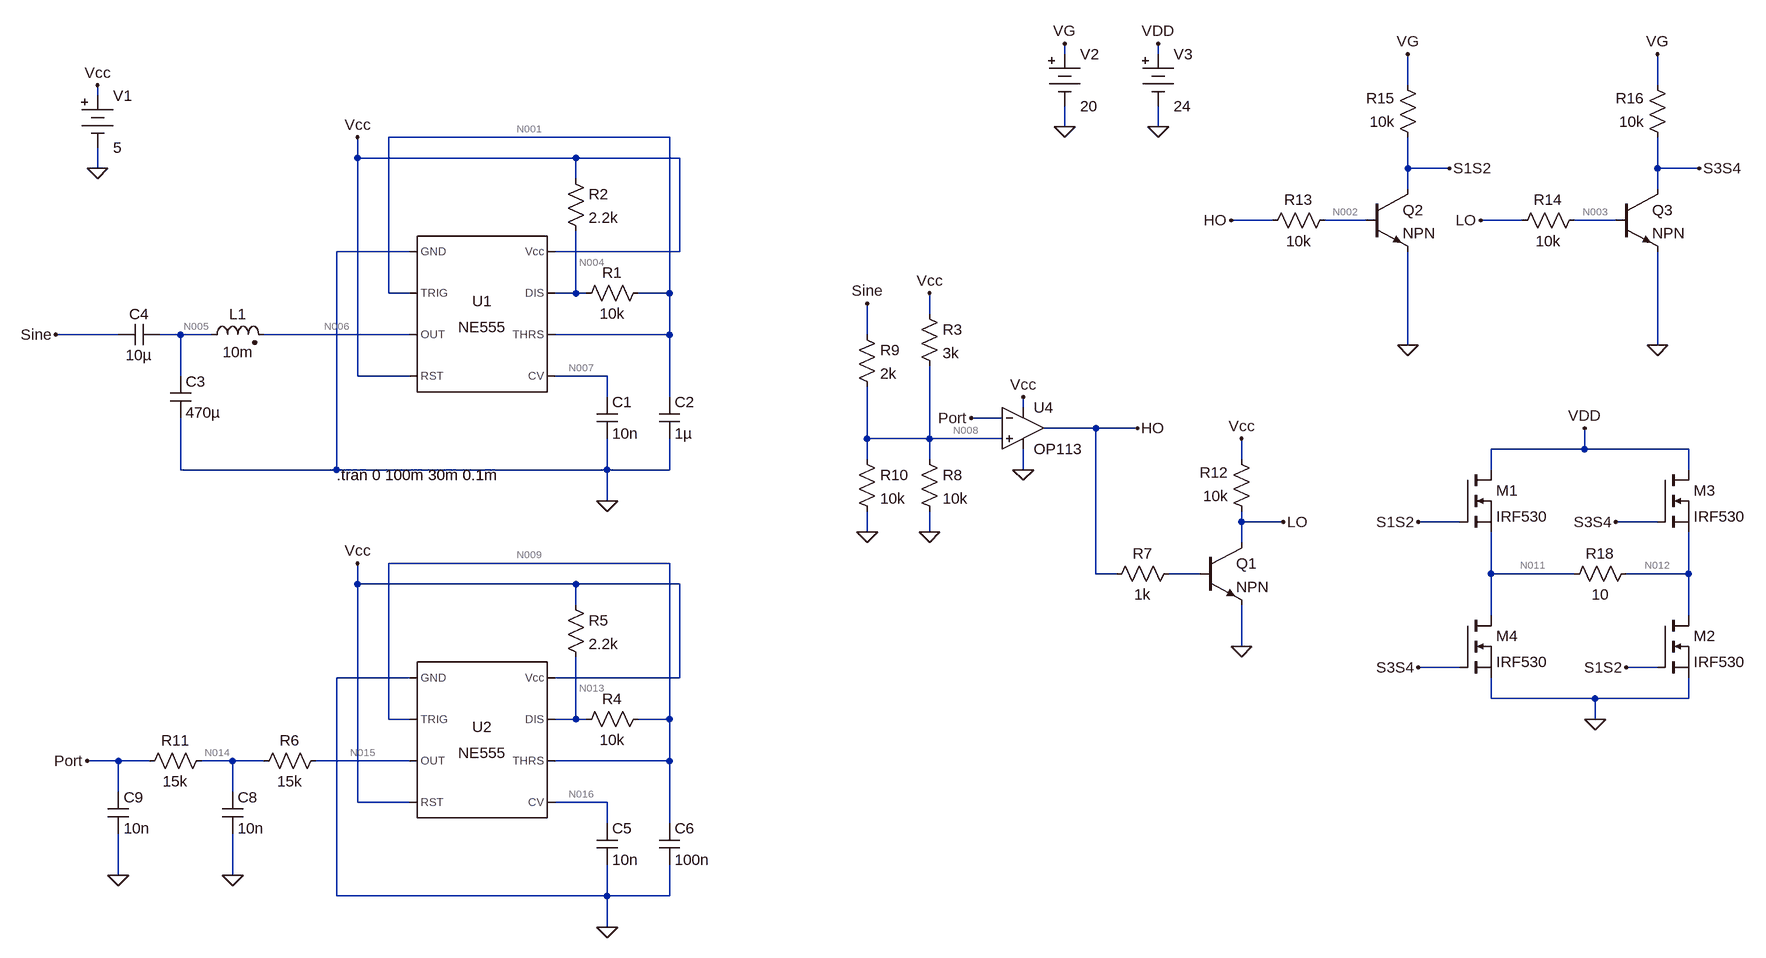
[diagram p0: schematic SPWM.asc]
SPWM.asc, the LTspice schematic file:
Version 4
SHEET 1 3300 1176
WIRE 1072 -208 1072 -224
WIRE 1216 -208 1216 -224
WIRE 1600 -160 1600 -208
WIRE 1984 -160 1984 -208
WIRE -416 -144 -416 -160
WIRE 1072 -96 1072 -128
WIRE 1216 -96 1216 -128
WIRE 464 -80 32 -80
WIRE -16 -48 -16 -80
WIRE 320 -48 -16 -48
WIRE 480 -48 320 -48
WIRE -416 -32 -416 -64
WIRE 1600 -32 1600 -80
WIRE 1664 -32 1600 -32
WIRE 1984 -32 1984 -80
WIRE 2048 -32 1984 -32
WIRE 320 -16 320 -48
WIRE 1600 0 1600 -32
WIRE 1984 0 1984 -32
WIRE 1392 48 1328 48
WIRE 1536 48 1472 48
WIRE 1776 48 1712 48
WIRE 1920 48 1856 48
WIRE 64 96 -48 96
WIRE 480 96 480 -48
WIRE 480 96 288 96
WIRE 32 160 32 -80
WIRE 64 160 32 160
WIRE 320 160 320 64
WIRE 320 160 288 160
WIRE 336 160 320 160
WIRE 464 160 464 -80
WIRE 464 160 416 160
WIRE 864 192 864 160
WIRE -384 224 -480 224
WIRE -288 224 -320 224
WIRE -240 224 -288 224
WIRE 64 224 -160 224
WIRE 464 224 464 160
WIRE 464 224 288 224
WIRE 768 224 768 176
WIRE 1600 240 1600 96
WIRE 1984 240 1984 96
WIRE -288 288 -288 224
WIRE -16 288 -16 -48
WIRE 64 288 -16 288
WIRE 368 288 288 288
WIRE 368 320 368 288
WIRE 464 320 464 224
WIRE 1008 336 1008 320
WIRE 976 352 928 352
WIRE 1120 368 1040 368
WIRE 1184 368 1120 368
WIRE 768 384 768 304
WIRE 864 384 864 272
WIRE 864 384 768 384
WIRE 976 384 864 384
WIRE 1872 400 1872 368
WIRE 1872 400 1728 400
WIRE 2032 400 1872 400
WIRE 768 416 768 384
WIRE 864 416 864 384
WIRE 1344 416 1344 384
WIRE -288 432 -288 352
WIRE -48 432 -48 96
WIRE -48 432 -288 432
WIRE 368 432 368 384
WIRE 368 432 -48 432
WIRE 464 432 464 384
WIRE 464 432 368 432
WIRE 1008 432 1008 400
WIRE 1728 432 1728 400
WIRE 2032 432 2032 400
WIRE 368 480 368 432
WIRE 1344 512 1344 496
WIRE 1408 512 1344 512
WIRE 1680 512 1616 512
WIRE 1984 512 1920 512
WIRE 768 528 768 496
WIRE 864 528 864 496
WIRE 1344 544 1344 512
WIRE 464 576 32 576
WIRE 1120 592 1120 368
WIRE 1152 592 1120 592
WIRE 1280 592 1232 592
WIRE 1728 592 1728 528
WIRE 1856 592 1728 592
WIRE 2032 592 2032 528
WIRE 2032 592 1936 592
WIRE -16 608 -16 576
WIRE 320 608 -16 608
WIRE 480 608 320 608
WIRE 320 640 320 608
WIRE 1728 656 1728 592
WIRE 2032 656 2032 592
WIRE 1344 704 1344 640
WIRE 1680 736 1616 736
WIRE 1984 736 1936 736
WIRE 64 752 -48 752
WIRE 480 752 480 608
WIRE 480 752 288 752
WIRE 1728 784 1728 752
WIRE 1888 784 1728 784
WIRE 2032 784 2032 752
WIRE 2032 784 1888 784
WIRE 32 816 32 576
WIRE 64 816 32 816
WIRE 320 816 320 720
WIRE 320 816 288 816
WIRE 336 816 320 816
WIRE 464 816 464 576
WIRE 464 816 416 816
WIRE 1888 816 1888 784
WIRE -384 880 -432 880
WIRE -336 880 -384 880
WIRE -208 880 -256 880
WIRE -160 880 -208 880
WIRE 64 880 -80 880
WIRE 464 880 464 816
WIRE 464 880 288 880
WIRE -384 928 -384 880
WIRE -208 928 -208 880
WIRE -16 944 -16 608
WIRE 64 944 -16 944
WIRE 368 944 288 944
WIRE 368 976 368 944
WIRE 464 976 464 880
WIRE -384 1056 -384 992
WIRE -208 1056 -208 992
WIRE -48 1088 -48 752
WIRE 368 1088 368 1040
WIRE 368 1088 -48 1088
WIRE 464 1088 464 1040
WIRE 464 1088 368 1088
WIRE 368 1136 368 1088
FLAG 368 480 0
FLAG -16 -80 Vcc
FLAG -416 -160 Vcc
FLAG -416 -32 0
FLAG -480 224 Sine
FLAG 368 1136 0
FLAG -16 576 Vcc
FLAG -432 880 Port
FLAG 928 352 Port
FLAG 1008 320 Vcc
FLAG 1008 432 0
FLAG 768 176 Sine
FLAG 768 528 0
FLAG -208 1056 0
FLAG -384 1056 0
FLAG 1344 704 0
FLAG 1344 384 Vcc
FLAG 1184 368 HO
FLAG 1408 512 LO
FLAG 864 528 0
FLAG 864 160 Vcc
FLAG 1600 240 0
FLAG 1072 -224 VG
FLAG 1072 -96 0
FLAG 1600 -208 VG
FLAG 1328 48 HO
FLAG 1984 240 0
FLAG 1984 -208 VG
FLAG 1712 48 LO
FLAG 1664 -32 S1S2
FLAG 2048 -32 S3S4
FLAG 1888 816 0
FLAG 1216 -224 VDD
FLAG 1216 -96 0
FLAG 1872 368 VDD
FLAG 1616 512 S1S2
FLAG 1936 736 S1S2
FLAG 1616 736 S3S4
FLAG 1920 512 S3S4
SYMBOL Misc\\NE555 176 192 R0
SYMATTR InstName U1
SYMBOL cap 352 320 R0
SYMATTR InstName C1
SYMATTR Value 10n
SYMBOL cap 448 320 R0
SYMATTR InstName C2
SYMATTR Value 1µ
SYMBOL Misc\\battery -416 -160 R0
WINDOW 123 0 0 Left 0
WINDOW 39 0 0 Left 0
SYMATTR InstName V1
SYMATTR Value 5
SYMBOL res 432 144 R90
WINDOW 0 0 56 VBottom 2
WINDOW 3 32 56 VTop 2
SYMATTR InstName R1
SYMATTR Value 10k
SYMBOL res 304 -32 R0
SYMATTR InstName R2
SYMATTR Value 2.2k
SYMBOL cap -304 288 R0
SYMATTR InstName C3
SYMATTR Value 470µ
SYMBOL ind2 -256 240 R270
WINDOW 0 32 56 VTop 2
WINDOW 3 5 56 VBottom 2
SYMATTR InstName L1
SYMATTR Value 10m
SYMATTR Type ind
SYMBOL cap -320 208 R90
WINDOW 0 0 32 VBottom 2
WINDOW 3 32 32 VTop 2
SYMATTR InstName C4
SYMATTR Value 10µ
SYMBOL Misc\\NE555 176 848 R0
SYMATTR InstName U2
SYMBOL cap 352 976 R0
SYMATTR InstName C5
SYMATTR Value 10n
SYMBOL cap 448 976 R0
SYMATTR InstName C6
SYMATTR Value 100n
SYMBOL res 432 800 R90
WINDOW 0 0 56 VBottom 2
WINDOW 3 32 56 VTop 2
SYMATTR InstName R4
SYMATTR Value 10k
SYMBOL res 304 624 R0
SYMATTR InstName R5
SYMATTR Value 2.2k
SYMBOL OpAmps\\OP113 1008 304 R0
SYMATTR InstName U4
SYMBOL res 752 208 R0
SYMATTR InstName R9
SYMATTR Value 2k
SYMBOL res 752 400 R0
SYMATTR InstName R10
SYMATTR Value 10k
SYMBOL res -64 864 R90
WINDOW 0 0 56 VBottom 2
WINDOW 3 32 56 VTop 2
SYMATTR InstName R6
SYMATTR Value 15k
SYMBOL res -240 864 R90
WINDOW 0 0 56 VBottom 2
WINDOW 3 32 56 VTop 2
SYMATTR InstName R11
SYMATTR Value 15k
SYMBOL cap -224 928 R0
SYMATTR InstName C8
SYMATTR Value 10n
SYMBOL cap -400 928 R0
SYMATTR InstName C9
SYMATTR Value 10n
SYMBOL npn 1280 544 R0
SYMATTR InstName Q1
SYMBOL res 1248 576 R90
WINDOW 0 0 56 VBottom 2
WINDOW 3 32 56 VTop 2
SYMATTR InstName R7
SYMATTR Value 1k
SYMBOL res 1360 512 R180
WINDOW 0 36 76 Left 2
WINDOW 3 36 40 Left 2
SYMATTR InstName R12
SYMATTR Value 10k
SYMBOL res 848 176 R0
SYMATTR InstName R3
SYMATTR Value 3k
SYMBOL res 848 400 R0
SYMATTR InstName R8
SYMATTR Value 10k
SYMBOL npn 1536 0 R0
SYMATTR InstName Q2
SYMBOL Misc\\battery 1072 -224 R0
WINDOW 123 0 0 Left 0
WINDOW 39 0 0 Left 0
SYMATTR InstName V2
SYMATTR Value 20
SYMBOL res 1488 32 R90
WINDOW 0 0 56 VBottom 2
WINDOW 3 32 56 VTop 2
SYMATTR InstName R13
SYMATTR Value 10k
SYMBOL res 1616 -64 R180
WINDOW 0 36 76 Left 2
WINDOW 3 36 40 Left 2
SYMATTR InstName R15
SYMATTR Value 10k
SYMBOL npn 1920 0 R0
SYMATTR InstName Q3
SYMBOL res 1872 32 R90
WINDOW 0 0 56 VBottom 2
WINDOW 3 32 56 VTop 2
SYMATTR InstName R14
SYMATTR Value 10k
SYMBOL res 2000 -64 R180
WINDOW 0 36 76 Left 2
WINDOW 3 36 40 Left 2
SYMATTR InstName R16
SYMATTR Value 10k
SYMBOL Misc\\battery 1216 -224 R0
WINDOW 123 0 0 Left 0
WINDOW 39 0 0 Left 0
SYMATTR InstName V3
SYMATTR Value 24
SYMBOL nmos 1680 432 R0
SYMATTR InstName M1
SYMATTR Value IRF530
SYMBOL nmos 1984 656 R0
SYMATTR InstName M2
SYMATTR Value IRF530
SYMBOL nmos 1984 432 R0
SYMATTR InstName M3
SYMATTR Value IRF530
SYMBOL nmos 1680 656 R0
SYMATTR InstName M4
SYMATTR Value IRF530
SYMBOL res 1952 576 R90
WINDOW 0 0 56 VBottom 2
WINDOW 3 32 56 VTop 2
SYMATTR InstName R18
SYMATTR Value 10
TEXT -48 440 Left 2 !.tran 0 100m 30m 0.1m

The netlist it stands for:
* SPWM.asc
XU1 0 N001 N006 Vcc N007 N001 N004 Vcc NE555  ; pins GND TRIG OUT RST CV THRS DIS Vcc
C1 N007 0 10n
C2 N001 0 1µ
V1 Vcc 0 5
R1 N001 N004 10k
R2 Vcc N004 2.2k
C3 N005 0 470µ
L1 N005 N006 10m
C4 N005 Sine 10µ
XU2 0 N009 N015 Vcc N016 N009 N013 Vcc NE555  ; pins GND TRIG OUT RST CV THRS DIS Vcc
C5 N016 0 10n
C6 N009 0 100n
R4 N009 N013 10k
R5 Vcc N013 2.2k
XU4 N008 Port Vcc 0 HO OP113  ; pins In+ In- V+ V- OUT
R9 Sine N008 2k
R10 N008 0 10k
R6 N015 N014 15k
R11 N014 Port 15k
C8 N014 0 10n
C9 Port 0 10n
Q1 LO N010 0 0 NPN
R7 N010 HO 1k
R12 LO Vcc 10k
R3 Vcc N008 3k
R8 N008 0 10k
Q2 S1S2 N002 0 0 NPN
V2 VG 0 20
R13 N002 HO 10k
R15 S1S2 VG 10k
Q3 S3S4 N003 0 0 NPN
R14 N003 LO 10k
R16 S3S4 VG 10k
V3 VDD 0 24
M1 VDD S1S2 N011 N011 IRF530
M2 N012 S1S2 0 0 IRF530
M3 VDD S3S4 N012 N012 IRF530
M4 N011 S3S4 0 0 IRF530
R18 N012 N011 10
.model NPN NPN
.model PNP PNP
.lib standard.bjt
.model NMOS NMOS
.model PMOS PMOS
.lib standard.mos
.tran 0 100m 30m 0.1m
.lib NE555.sub
.lib ADI.lib
.backanno
.end

* Results of the author's LTspice run, read from the files saved beside the schematic
* Operating Point, zero values left out:
*   V(n001) = 5 V
*   V(n007) = 3.333 V
*   V(vcc) = 5 V
*   V(n004) = 5 V
*   V(n006) = 5 V
*   V(n005) = 5 V
*   V(sine) = 3.126 V
*   V(n009) = 5 V
*   V(n016) = 3.333 V
*   V(n013) = 5 V
*   V(n015) = 5 V
*   V(port) = 4.999 V
*   V(n008) = 3.126 V
*   V(n014) = 5 V
*   V(lo) = 2.898 V
*   V(s1s2) = 20 V
*   V(n002) = 200.5 nV
*   V(vg) = 20 V
*   V(s3s4) = 65.71 mV
*   V(n003) = 796.5 mV
*   V(vdd) = 24 V
*   V(n011) = 15.24 V
*   V(n012) = 112.7 mV
*   Ic(Q3) = 1.993 mA
*   Ib(Q3) = 210.2 µA
*   Ie(Q3) = -2.204 mA
*   Ic(Q2) = 20 pA
*   Ib(Q2) = -20 pA
*   Ic(Q1) = 2.898 pA
*   Ib(Q1) = -2.898 pA
*   Id(M4) = 67.18 pA
*   Is(M4) = -67.18 pA
*   Id(M3) = 75.85 pA
*   Is(M3) = -75.85 pA
*   Id(M2) = 1.512 A
*   Is(M2) = -1.512 A
*   Id(M1) = 1.512 A
*   Is(M1) = -1.512 A
*   I(R18) = -1.512 A
*   I(R16) = -1.993 mA
*   I(R14) = -210.2 µA
*   I(R15) = -20 pA
*   I(R13) = 20 pA
*   I(R8) = 312.6 µA
*   I(R3) = 624.7 µA
*   I(R12) = -210.2 µA
*   I(R7) = 2.898 pA
*   I(R11) = 25.01 nA
*   I(R6) = 25.01 nA
*   I(R10) = 312.6 µA
*   I(R5) = 16.67 nA
*   I(R4) = -10 nA
*   I(R2) = 16.67 nA
*   I(R1) = -10 nA
*   I(V3) = -1.512 A
*   I(V2) = -1.993 mA
*   I(V1) = -4.816 mA